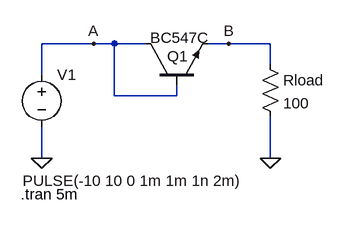
[diagram p0: schematic lab_1_1_npnAsDiode_solution.asc]
lab_1_1_npnAsDiode_solution.asc, the LTspice schematic file:
Version 4
SHEET 1 880 680
WIRE 0 128 -80 128
WIRE 32 128 0 128
WIRE 80 128 32 128
WIRE 208 128 176 128
WIRE 272 128 208 128
WIRE 272 160 272 128
WIRE -80 176 -80 128
WIRE 32 208 32 128
WIRE 128 208 128 192
WIRE 128 208 32 208
WIRE -80 304 -80 256
WIRE 272 304 272 240
FLAG -80 304 0
FLAG 0 128 A
FLAG 208 128 B
FLAG 272 304 0
SYMBOL npn 80 192 R270
WINDOW 0 45 33 VRight 2
WINDOW 3 73 7 VRight 2
SYMATTR InstName Q1
SYMATTR Value BC547C
SYMBOL voltage -80 160 R0
WINDOW 3 -29 179 Left 2
WINDOW 123 0 0 Left 0
WINDOW 39 0 0 Left 0
SYMATTR Value PULSE(-10 10 0 1m 1m 1n 2m)
SYMATTR InstName V1
SYMBOL res 256 144 R0
SYMATTR InstName Rload
SYMATTR Value 100
TEXT -112 360 Left 2 !.tran 5m

The netlist it stands for:
* lab_1_1_npnAsDiode_solution.asc
Q1 A A B 0 BC547C
V1 A 0 PULSE(-10 10 0 1m 1m 1n 2m)
Rload B 0 100
.model NPN NPN
.model PNP PNP
.lib standard.bjt
.tran 5m
.backanno
.end